# EAGLE schematic pot (EAGLE 9.6.2)

## Sheet 1 of 2
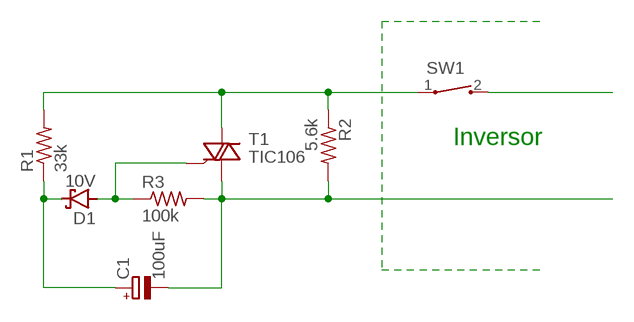
[diagram p0: schematic, sheet 1]

### Parts
C1  100uF  CPOL-EUE2.5-7  [E2,5-7]
D1  10V  1N5817-B  [DO41-7.6]
R1  33k  R-US_0204/7  [0204/7]
R2  5.6k  R-US_0204/7  [0204/7]
R3  100k  R-US_0204/7  [0204/7]
SW1  CT10-XXXX-A2  [CT10-XXXX-A2]
T1  TIC106  TIC206D  [TO220BV]

### Nets
N$1: R1.2 R2.1 SW1.1 T1.T2(A2)
N$2: C1.+ D1.C R1.1
N$3: D1.A R3.1 T1.G
N$4: C1.- R2.2 R3.2 T1.T1(A1)
N$6: SW1.2

### Notes on the sheet
- Inversor

## Sheet 2 of 2
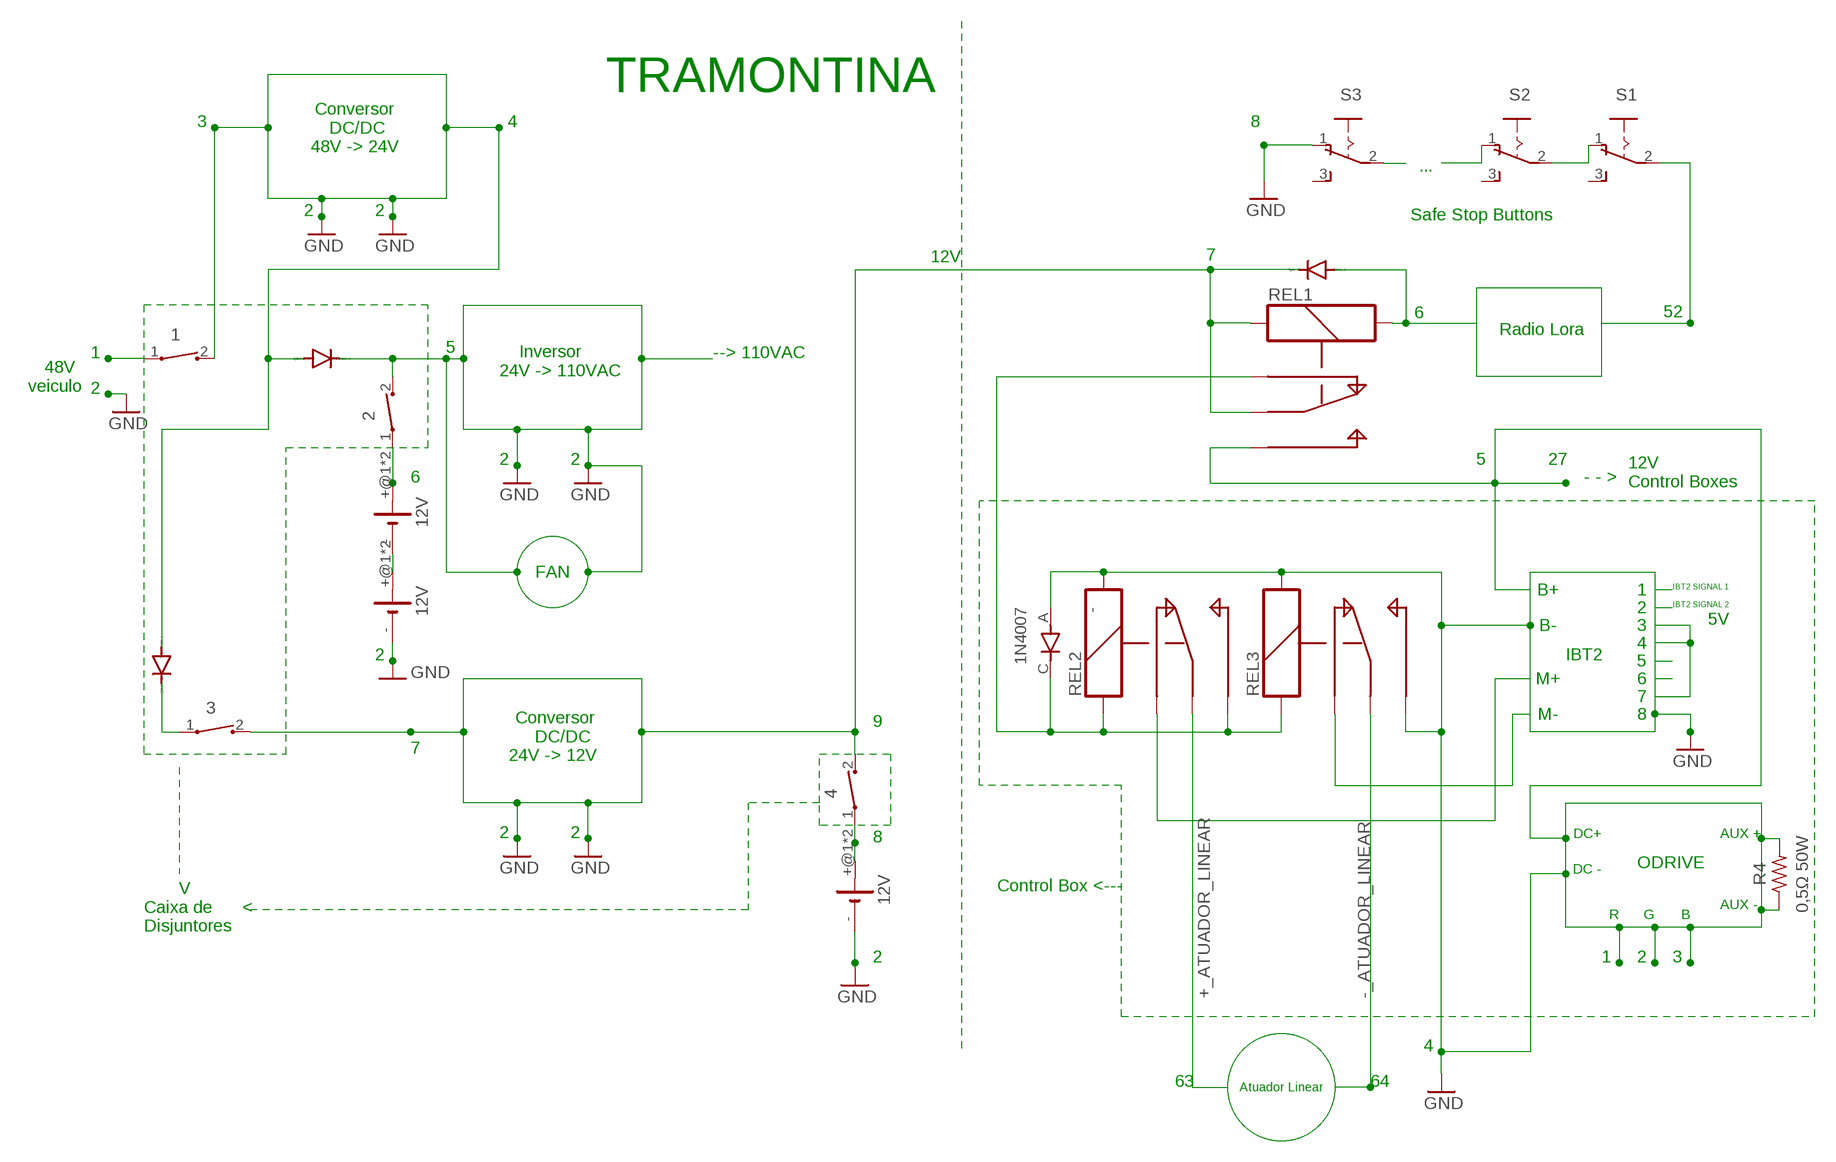
[diagram p1: schematic, sheet 2]

### Parts
1  CT10-XXXX-A2  [CT10-XXXX-A2]
2  CT10-XXXX-A2  [CT10-XXXX-A2]
3  CT10-XXXX-A2  [CT10-XXXX-A2]
4  CT10-XXXX-A2  [CT10-XXXX-A2]
-  1N4007  [DIOAD1060W80L520D270]
D2  1N4004  [DO41-10]
D3  1N4004  [DO41-10]
D5  1N4004  [DO41-10]
G1  12V  10MM_SM_COIN_CELL_CLIP  [10MM_SM_COIN_CELL_CLIP]
G2  12V  10MM_SM_COIN_CELL_CLIP  [10MM_SM_COIN_CELL_CLIP]
G3  12V  10MM_SM_COIN_CELL_CLIP  [10MM_SM_COIN_CELL_CLIP]
R4  0,5Ω 50W  R-US_AXIAL-11.7MM-PITCH  [RESAD1176W63L850D250B]
REL1  REL-5PIN  [REL-5PIN]
REL2  REL-5PIN  [REL-5PIN]
REL3  REL-5PIN  [REL-5PIN]
S1  255SB  [255SB]
S2  255SB  [255SB]
S3  255SB  [255SB]

### Nets
+_ATUADOR_LINEAR: REL2.C
-_ATUADOR_LINEAR: REL3.C
GND: 1.2 2.2 3.2 4.2 -.A D2.A D2.C D3.A D5.C G2.- G3.- R4.1 R4.2 REL1.C REL1.O REL1.S1 REL2.S2 REL3.O REL3.S2 S3.1(O)
N$5: -.C REL1.S REL2.O REL2.S1 REL3.S1
N$8: REL2.S
N$9: 1.1
N$11: 2.1 G1.+@1(+) G1.+@2(+)
N$12: G1.- G2.+@1(+) G2.+@2(+)
N$14: S3.2(P)
N$15: S1.1(O) S2.2(P)
N$17: 4.1 G3.+@1(+) G3.+@2(+)
N$18: S2.1(O)
N$19: D5.A REL1.S2
N$25: S1.2(P)
N$28: 3.1 D3.C
N$38: REL3.S
Unconnected: S1.3(S) S2.3(S) S3.3(S)

### Notes on the sheet
- TRAMONTINA
- 3
- Conversor 
  DC/DC
  48V -> 24V
- 4 | 8
- ...
- 2 | 2 | Safe Stop Buttons
- 12V | 7
- 52
- 6 | Radio Lora
- 5
- 1 | --> 110VAC
- 48V
  veiculo
- Inversor
  24V -> 110VAC
- 2
- 12V
  Control Boxes
- 2 | 2 | 5 | 27
- 6 | - - >
- FAN
- B+ | 1 | IBT2 SIGNAL 1
- 2 | IBT2 SIGNAL 2
- B- | 3 | 5V
- 4
- 2 | IBT2 | 5
- M+ | 6
- 7
- M- | 8
- 9
- Conversor
      DC/DC
  24V -> 12V
- 7
- 2 | 2 | 8 | DC+ | AUX +
- ODRIVE
- DC -
- Control Box <---
- R | G | B | AUX -
- V 
  Caixa de      <
  Disjuntores
- 2 | 1 | 2 | 3
- 4
- 63 | Atuador Linear | 64

## Library data of the parts
1-4 SW1 = switch-coto:CT10-XXXX-: CT10 Series Molded Switch Source: www.cotorelay.com .. Coto_Technology__CT10-1530-G1.pdf
- = 1N4007:1N4007: Diode Switching 1KV 1A 2-Pin DO-41 Check availability <https://pricing.snapeda.com/parts/1N4007/ON%20Semiconductor/view-part?ref=eda>; AVAILABILITY: In Stock; DESCRIPTION: Diode Standard 1000V 1A Through Hole DO-204AL (DO-41); MF: ON Semiconductor; MP: 1N4007; PACKAGE: DO-41-2 ON Semiconductor; PRICE: None
C1 = rcl:CPOL-EU: POLARIZED CAPACITOR, European symbol; SPICEPREFIX: C
D1 = diode:1N581*: 1.0A SCHOTTKY BARRIER RECTIFIER Source: http://www.diodes.com/datasheets/ds23001.pdf
D2 D3 D5 = diode:1N4004: DIODE general purpose rectifier, 1 A
G1-G3 = battery:10MM_SM_COIN_CELL_CLIP: Battery cell clip for CR927 Source: KEYSTONE ELECTRONICS CORP. www.keyelco.com, ASTORIA, N.Y. 11105-2017 PART ANME 10mm SM COIN CELl CLIP DWG NO. 3030
R1-R3 = rcl:R-US_: RESISTOR, American symbol; SPICEPREFIX: R
R4 = Resistor:R-US: Resistor Fixed - ANSI; CATEGORY: Resistor; SUB-CATEGORY: Fixed
REL1-REL3 = special:REL-5PIN: RELAY
S1-S3 = switch:255SB: SLIDING SWITCH Distributor Buerklin, 11G810
T1 = triac:TIC206: TRIAC Source: http://www.bourns.com/pdfs/tic206.pdf